# Altium schematic sheet servo_header_board.SchDoc: Regbot Servo Board
size A4; DrawnBy: TTAN; Engineer: TTAN; Revision: 1.0; SheetNumber: 1; SheetTotal: 1; ProjectName: Regbot Servo Board
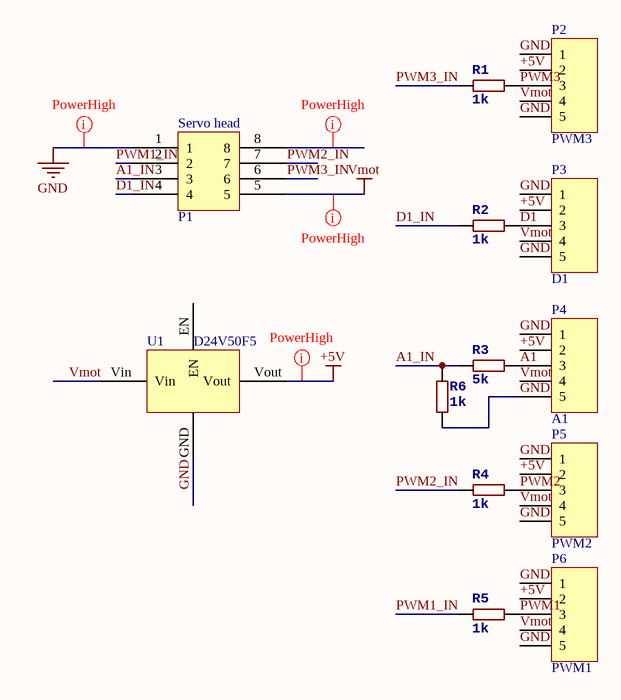
[diagram p0: servo_header_board.SchDoc]

## Parts
P1  Servo head  [HOUSED8]
P2  PWM3  [HDR1X5]
P3  D1  [HDR1X5]
P4  A1  [HDR1X5]
P5  PWM2  [HDR1X5]
P6  PWM1  [HDR1X5]
R1  1k  [R0805]
R2  1k  [R0805]
R3  5k  [R0805]
R4  1k  [R0805]
R5  1k  [R0805]
R6  1k  [R0805]
U1  D24V50F5  [D24V50F5-hori]

## Nets
+5V: P2.2 P3.2 P4.2 P5.2 P6.2 U1.Vout
GND: P1.1 P2.1 P2.5 P3.1 P3.5 P4.1 P4.5 P5.1 P5.5 P6.1 P6.5 R6.1 U1.GND
Vmot: P1.5 P2.4 P3.4 P4.4 P5.4 P6.4 U1.Vin
A1: P4.3 R3.2
A1_IN: P1.3 R3.1 R6.2
D1: P3.3 R2.2
D1_IN: P1.4 R2.1
PWM1: P6.3 R5.2
PWM1_IN: P1.2 R5.1
PWM2: P5.3 R4.2
PWM2_IN: P1.7 R4.1
PWM3: P2.3 R1.2
PWM3_IN: P1.6 R1.1

Not connected (* = marked no-connect by the designer): P1 8; U1 EN

## Layout directives
net class PowerHigh: +5V, GND, NetP1_8, Vmot

## Notes on the sheet
- Title
- Size:
- Date:
- A4
- Number:
- Time:
- Revision:
- Sheet
- of
- File:

## Library data of the parts
P1 = PIN_HOUSED_8
P2-P6 = Header 5: Header, 5-Pin; LatestRevisionDate: 17-Jul-2002; LatestRevisionNote: Re-released for DXP Platform.; Publisher: Altium Limited
R1-R6 = R-EU: RESISTOR, European symbol
  R1 R2 R4-R6: Value: 1k
  R3: Value: 5k
U1 = D24V50F5: Pololu 5V, 5A Step-Down Voltage Regulator; URL: https://www.pololu.com/product/2851; Vout: 5V